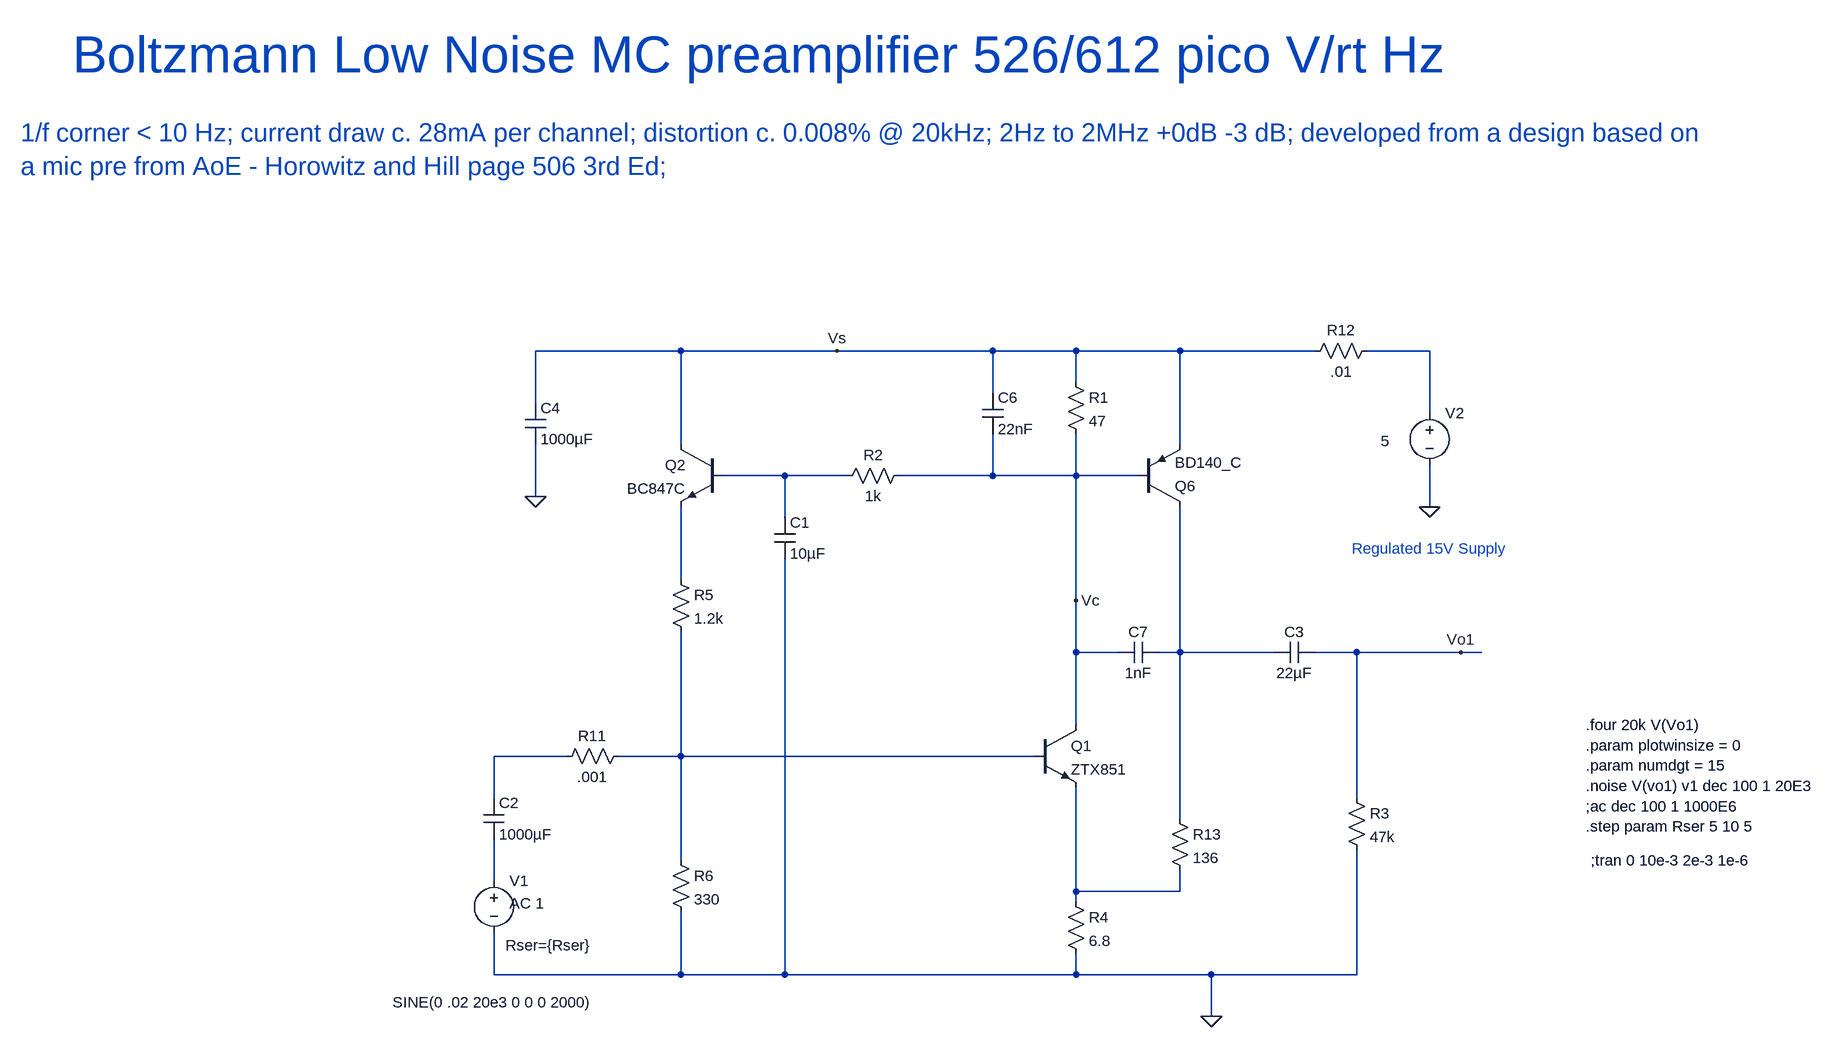
[diagram p0: schematic Boltzmann.asc]
Boltzmann.asc, the LTspice schematic file:
Version 4
SHEET 1 1520 1304
WIRE -1552 -48 -1776 -48
WIRE -1312 -48 -1552 -48
WIRE -1072 -48 -1312 -48
WIRE -944 -48 -1072 -48
WIRE -784 -48 -944 -48
WIRE -576 -48 -784 -48
WIRE -400 -48 -496 -48
WIRE -944 0 -944 -48
WIRE -1072 16 -1072 -48
WIRE -1776 32 -1776 -48
WIRE -400 48 -400 -48
WIRE -1552 96 -1552 -48
WIRE -784 96 -784 -48
WIRE -1392 144 -1488 144
WIRE -1296 144 -1392 144
WIRE -1072 144 -1072 80
WIRE -1072 144 -1216 144
WIRE -944 144 -944 80
WIRE -944 144 -1072 144
WIRE -848 144 -944 144
WIRE -1776 176 -1776 96
WIRE -400 192 -400 128
WIRE -1392 208 -1392 144
WIRE -1552 304 -1552 192
WIRE -944 336 -944 144
WIRE -944 416 -944 336
WIRE -880 416 -944 416
WIRE -784 416 -784 192
WIRE -784 416 -816 416
WIRE -640 416 -784 416
WIRE -512 416 -576 416
WIRE -352 416 -512 416
WIRE -320 416 -352 416
WIRE -944 528 -944 416
WIRE -1728 576 -1840 576
WIRE -1552 576 -1552 384
WIRE -1552 576 -1648 576
WIRE -1008 576 -1552 576
WIRE -1840 640 -1840 576
WIRE -512 640 -512 416
WIRE -784 672 -784 416
WIRE -1552 736 -1552 576
WIRE -1840 768 -1840 704
WIRE -944 784 -944 624
WIRE -784 784 -784 752
WIRE -784 784 -944 784
WIRE -944 800 -944 784
WIRE -1840 912 -1840 848
WIRE -1552 912 -1552 816
WIRE -1552 912 -1840 912
WIRE -1392 912 -1392 272
WIRE -1392 912 -1552 912
WIRE -944 912 -944 880
WIRE -944 912 -1392 912
WIRE -736 912 -944 912
WIRE -512 912 -512 720
WIRE -512 912 -736 912
WIRE -736 976 -736 912
FLAG -400 192 0
FLAG -736 976 0
FLAG -352 416 Vo1
FLAG -944 336 Vc
FLAG -1776 176 0
FLAG -1312 -48 Vs
SYMBOL npn -1008 528 R0
SYMATTR InstName Q1
SYMATTR Value ZTX851
SYMBOL voltage -1840 752 R0
WINDOW 3 -156 203 Left 2
WINDOW 123 24 50 Left 2
WINDOW 39 18 115 Left 2
SYMATTR Value SINE(0 .02 20e3 0 0 0 2000)
SYMATTR Value2 AC 1
SYMATTR SpiceLine Rser={Rser}
SYMATTR InstName V1
SYMBOL voltage -400 32 R0
WINDOW 3 -75 59 Left 2
WINDOW 123 24 50 Left 2
WINDOW 39 0 0 Left 2
SYMATTR Value 5
SYMATTR InstName V2
SYMBOL cap -576 400 R90
WINDOW 0 0 32 VBottom 2
WINDOW 3 32 32 VTop 2
SYMATTR InstName C3
SYMATTR Value 22µF
SYMBOL npn -1488 96 M0
SYMATTR InstName Q2
SYMATTR Value BC847C
SYMBOL res -960 -16 R0
SYMATTR InstName R1
SYMATTR Value 47
SYMBOL res -1568 288 R0
SYMATTR InstName R5
SYMATTR Value 1.2k
SYMBOL res -1568 720 R0
SYMATTR InstName R6
SYMATTR Value 330
SYMBOL res -1200 128 R90
WINDOW 0 0 56 VBottom 2
WINDOW 3 32 56 VTop 2
SYMATTR InstName R2
SYMATTR Value 1k
SYMBOL cap -1408 208 R0
SYMATTR InstName C1
SYMATTR Value 10µF
SYMBOL res -528 624 R0
SYMATTR InstName R3
SYMATTR Value 47k
SYMBOL res -960 784 R0
SYMATTR InstName R4
SYMATTR Value 6.8
SYMBOL cap -1792 32 R0
SYMATTR InstName C4
SYMATTR Value 1000µF
SYMBOL res -480 -64 R90
WINDOW 0 0 56 VBottom 2
WINDOW 3 32 56 VTop 2
SYMATTR InstName R12
SYMATTR Value .01
SYMBOL cap -816 400 R90
WINDOW 0 0 32 VBottom 2
WINDOW 3 32 32 VTop 2
SYMATTR InstName C7
SYMATTR Value 1nF
SYMBOL pnp -848 192 M180
SYMATTR InstName Q6
SYMATTR Value BD140_C
SYMBOL res -800 656 R0
SYMATTR InstName R13
SYMATTR Value 136
SYMBOL cap -1088 16 R0
SYMATTR InstName C6
SYMATTR Value 22nF
SYMBOL res -1632 560 R90
WINDOW 0 0 56 VBottom 2
WINDOW 3 32 56 VTop 2
SYMATTR InstName R11
SYMATTR Value .001
SYMBOL cap -1856 640 R0
SYMATTR InstName C2
SYMATTR Value 1000µF
TEXT -152 736 Left 2 !;tran 0 10e-3 2e-3 1e-6
TEXT -160 528 Left 2 !.four 20k V(Vo1)\n.param plotwinsize = 0\n.param numdgt = 15\n.noise V(vo1) v1 dec 100 1 20E3\n;ac dec 100 1 1000E6\n.step param Rser 5 10 5
TEXT -2488 -504 Left 6 ;Boltzmann Low Noise MC preamplifier 526/612 pico V/rt Hz
TEXT -2568 -384 Left 4 ;1/f corner < 10 Hz; current draw c. 28mA per channel; distortion c. 0.008% @ 20kHz; 2Hz to 2MHz +0dB -3 dB; developed from a design based on  \na mic pre from AoE - Horowitz and Hill page 506 3rd Ed;
TEXT -520 256 Left 2 ;Regulated 15V Supply

The netlist it stands for:
* Boltzmann.asc
Q1 Vc N006 N008 0 ZTX851
V1 N007 0 SINE(0 .02 20e3 0 0 0 2000) AC 1 Rser={Rser}
V2 N001 0 5
C3 Vo1 N004 22µF
Q2 Vs N002 N003 0 BC847C
R1 Vs Vc 47
R5 N003 N006 1.2k
R6 N006 0 330
R2 Vc N002 1k
C1 N002 0 10µF
R3 Vo1 0 47k
R4 N008 0 6.8
C4 Vs 0 1000µF
R12 N001 Vs .01
C7 N004 Vc 1nF
Q6 N004 Vc Vs 0 BD140_C
R13 N004 N008 136
C6 Vs Vc 22nF
R11 N006 N005 .001
C2 N005 N007 1000µF
.model NPN NPN
.model PNP PNP
.lib standard.bjt
;tran 0 10e-3 2e-3 1e-6
.four 20k V(Vo1)
.param plotwinsize = 0
.param numdgt = 15
.noise V(vo1) v1 dec 100 1 20E3
;ac dec 100 1 1000E6
.step param Rser 5 10 5
* Boltzmann Low Noise MC preamplifier 526/612 pico V/rt Hz
* 1/f corner < 10 Hz; current draw c. 28mA per channel; distortion c. 0.008% @ 20kHz; 2Hz to 2MHz +0dB -3 dB; developed from a design based on
* a mic pre from AoE - Horowitz and Hill page 506 3rd Ed;
* Regulated 15V Supply
.backanno
.end